# Altium project PROC101D_SCH_With_Design_Updates..Notes_V1.0.PrjPcb (part 21 of 23)

## Sheet 39.SchDoc
size 513 x 386 mm
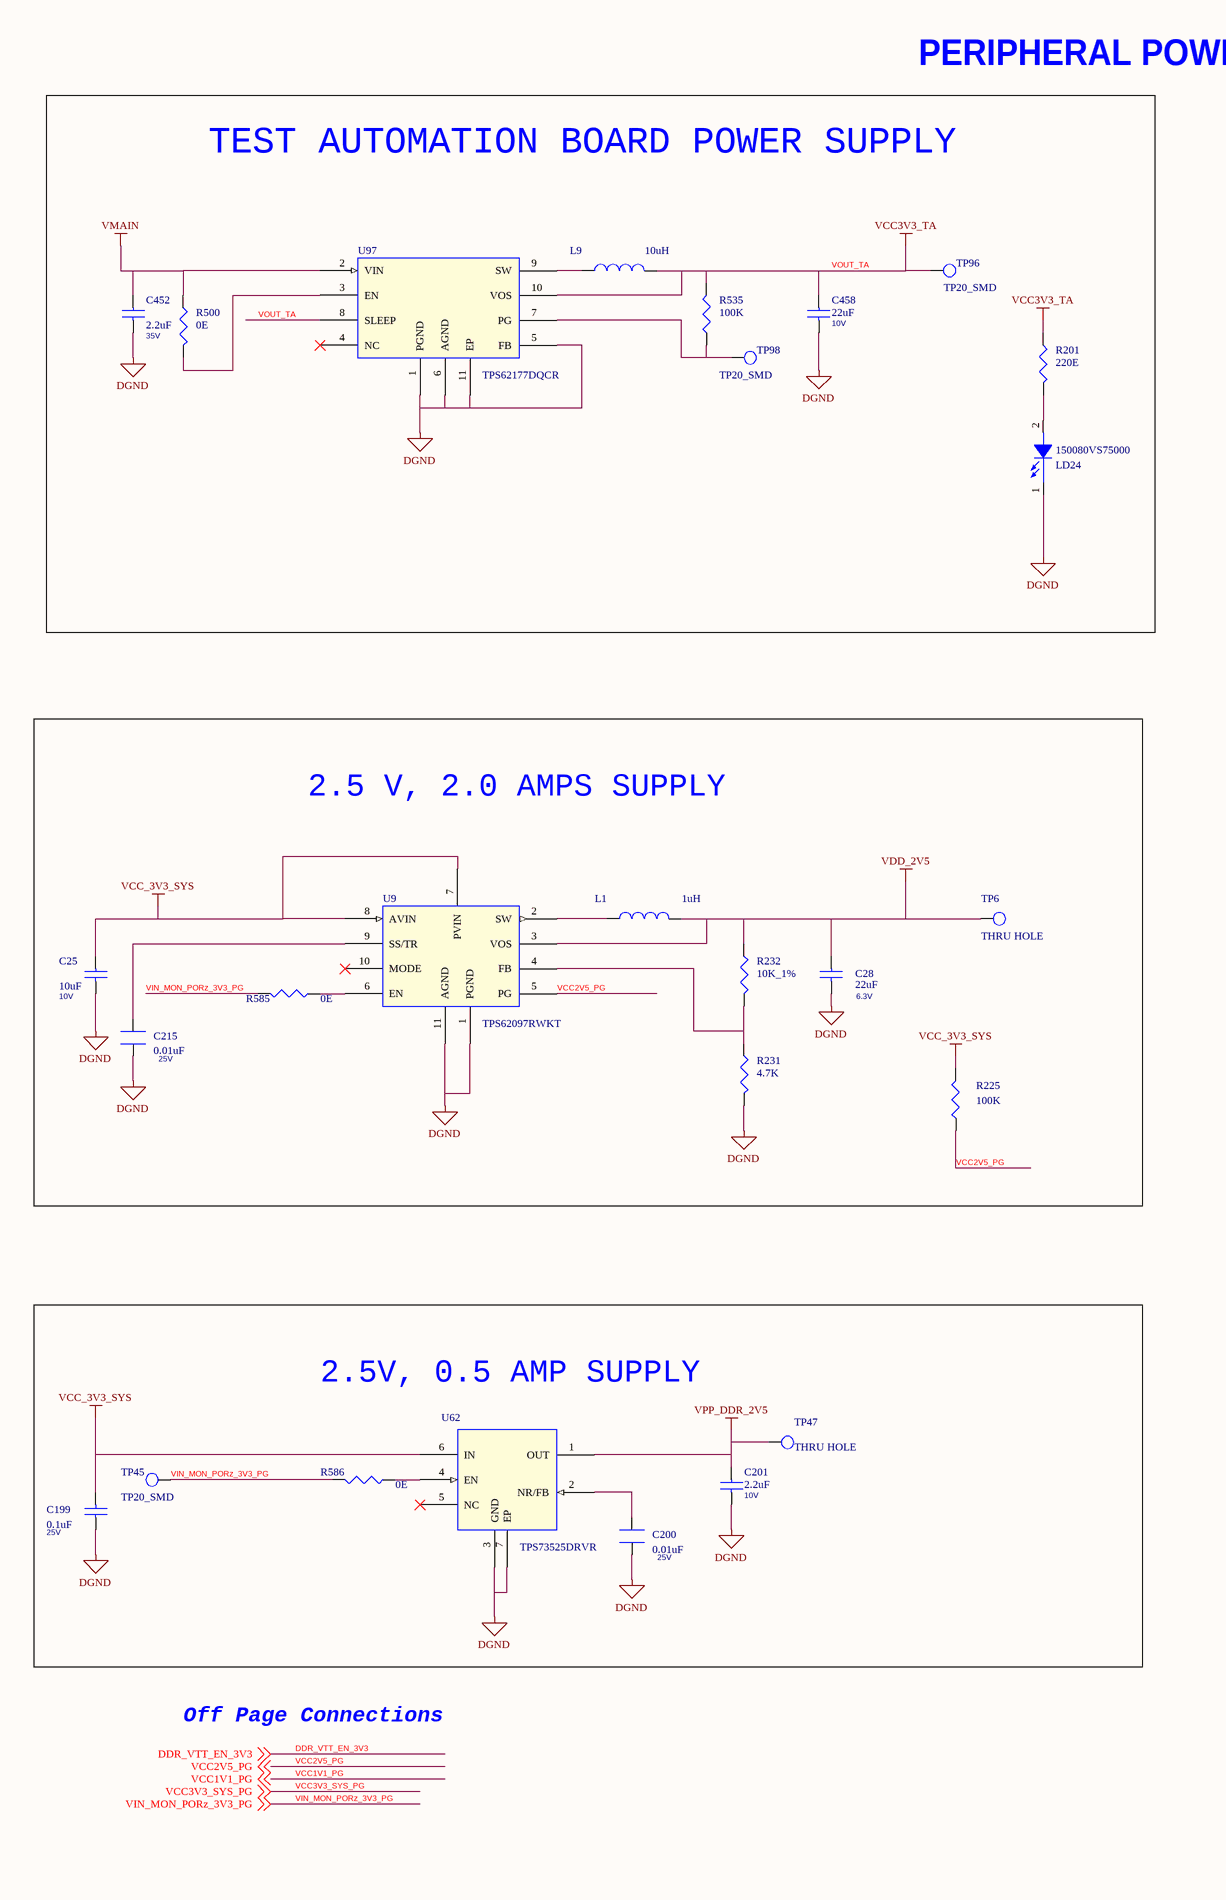
[diagram p74: 39.SchDoc, left]
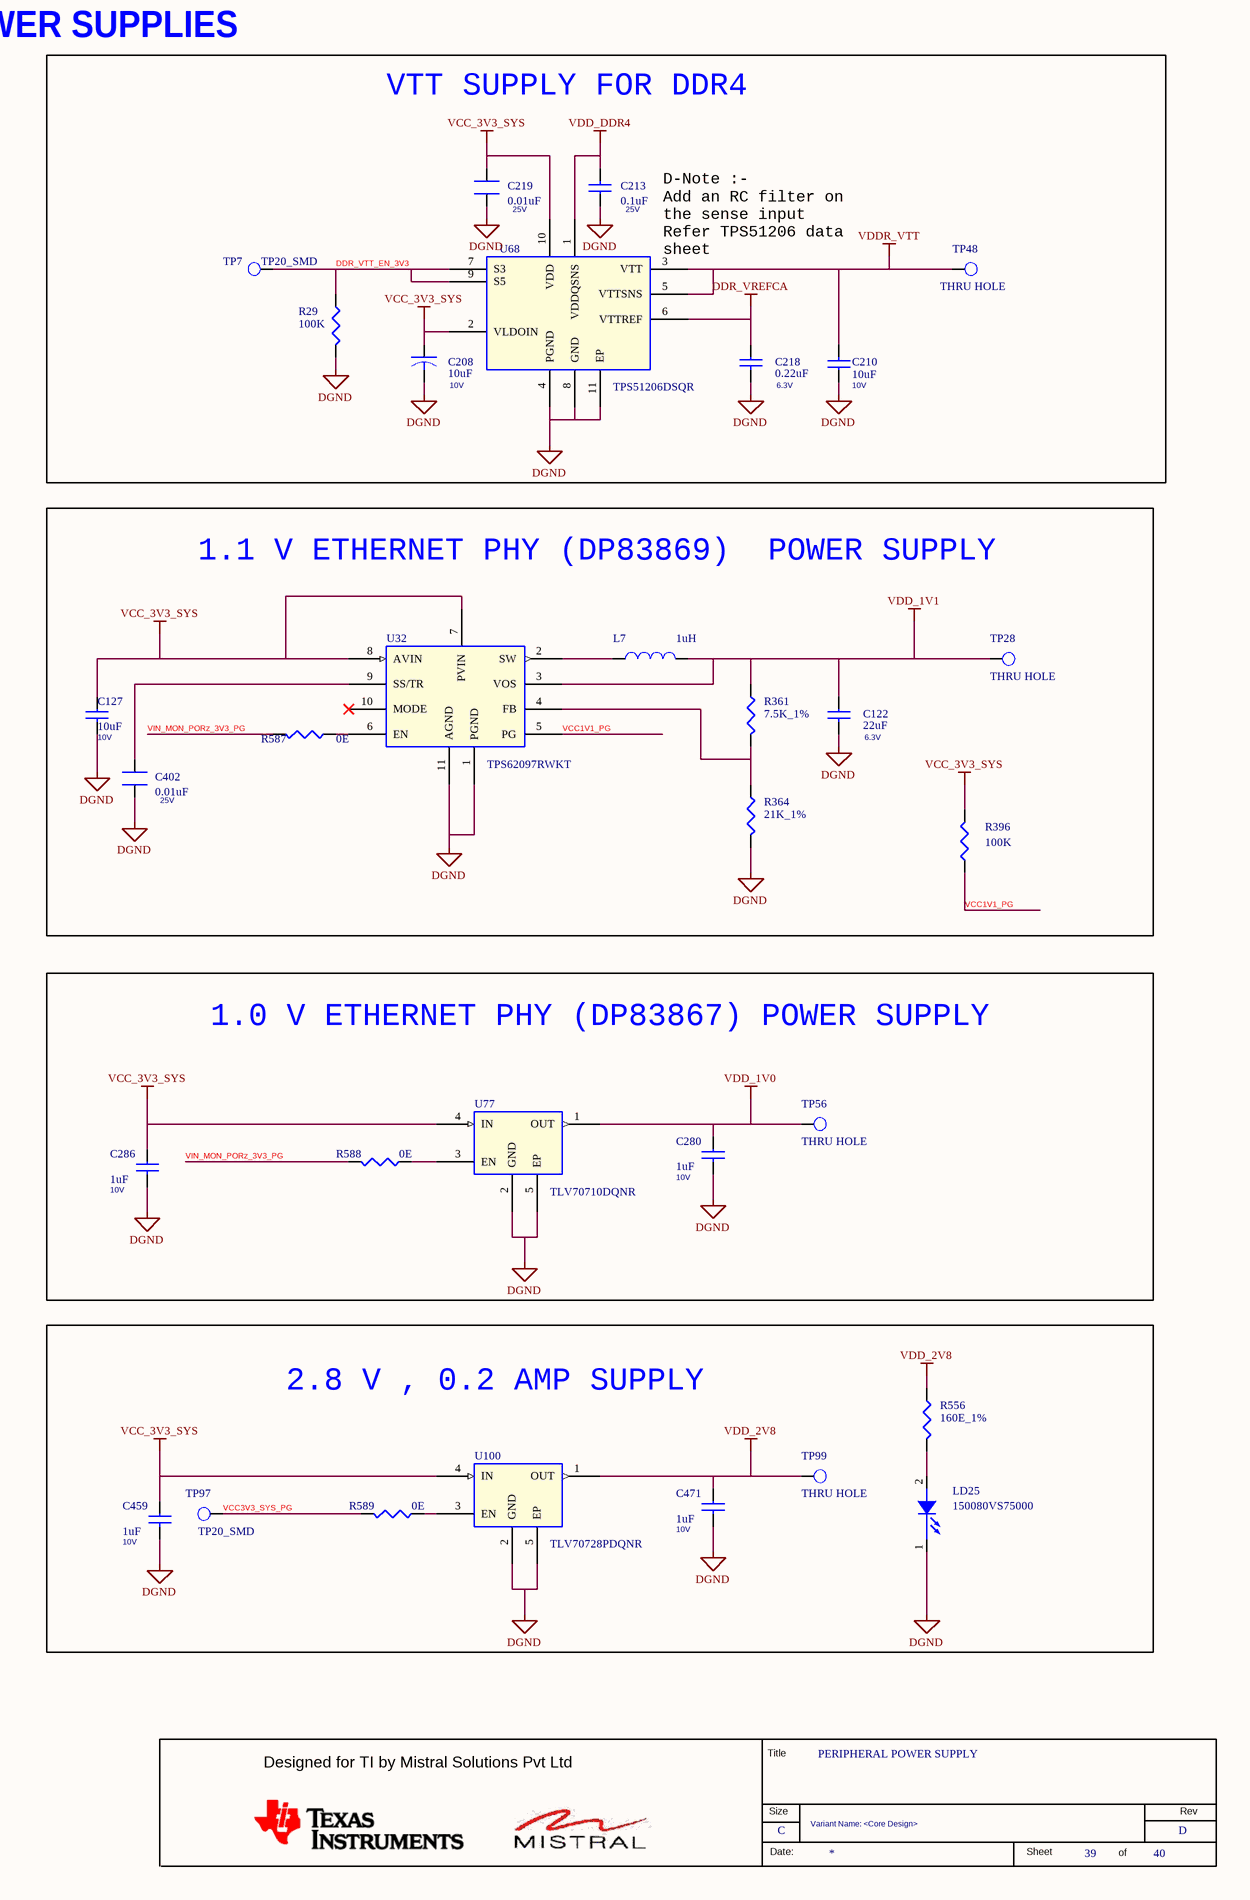
[diagram p75: 39.SchDoc, right]

### Parts
(Parts that share a designator on the sheet are numbered #1, #2 ... from top to bottom, then left to right.)
*#39  RevCode: D  Title: PERIPHERAL POWER SUPPLY  Page Size: C  Page Number: 39  Page Count: 40  Variant Name: <Core Design>  (hidden comment: MISTRAL_TITLEBLK_CSIZE)  (graphical)
C25  10uF  Voltage: 10V  [CAP0402_0-75]
C28  22uF  Voltage: 6.3V  [CAP0603_1]
C122  22uF  Voltage: 6.3V  [CAP0603_1]
C127  10uF  Voltage: 10V  [CAP0402_0-75]
C199  0.1uF  Voltage: 25V  [CAP0402_0-75]
C200  0.01uF  Voltage: 25V  [CAP0402N]
C201  2.2uF  Voltage: 10V  [CAP0402_0-75]
C208  10uF  Voltage: 10V  [CAP0402_0-75]
C210  10uF  Voltage: 10V  [CAP0402_0-75]
C213  0.1uF  Voltage: 25V  [CAP0402_0-75]
C215  0.01uF  Voltage: 25V  [CAP0402N]
C218  0.22uF  Voltage: 6.3V  [CAP0201_0-5]
C219  0.01uF  Voltage: 25V  [CAP0402N]
C280  1uF  Voltage: 10V  [CAP0402_0-75]
C286  1uF  Voltage: 10V  [CAP0402_0-75]
C402  0.01uF  Voltage: 25V  [CAP0402N]
C452  2.2uF  Voltage: 35V  [CAP0603_1]
C458  22uF  Voltage: 10V  [CAP0805_1-5]
C459  1uF  Voltage: 10V  [CAP0402_0-75]
C471  1uF  Voltage: 10V  [CAP0402_0-75]
L1  1uH  [IND_744316100_230X220_SMD_4-3]
L7  1uH  [IND_744316100_230X220_SMD_4-3]
L9  10uH  [IND_74438336100_130X130_SMD_2]
LD24  150080VS75000  [LED_150080VS75000_80X50_SMD_0-8]
LD25  150080VS75000  [LED_150080VS75000_80X50_SMD_0-8]
R29  100K  [RES0402_0-5]
R201  220E  [RES0402_0-5]
R225  100K  [RES0402_0-5]
R231  4.7K  [RES0402_0-5]
R232  10K_1%  [RES0402_0-5]
R361  7.5K_1%  [RES0402_0-5]
R364  21K_1%  [RES0402_0-5]
R396  100K  [RES0402_0-5]
R500  0E  [RES0402_0-5]
R535  100K  [RES0402_0-5]
R556  160E_1%  [RES0402_0-5]
R585  0E  [RES0402_0-5]
R586  0E  [RES0402_0-5]
R587  0E  [RES0402_0-5]
R588  0E  [RES0402_0-5]
R589  0E  [RES0402_0-5]
TP6  THRU HOLE  [TP_40X65]
TP7  TP20_SMD  [TP20_SMD]
TP28  THRU HOLE  [TP_40X65]
TP45  TP20_SMD  [TP20_SMD]
TP47  THRU HOLE  [TP_40X65]
TP48  THRU HOLE  [TP_40X65]
TP56  THRU HOLE  [TP_40X65]
TP96  TP20_SMD  [TP20_SMD]
TP97  TP20_SMD  [TP20_SMD]
TP98  TP20_SMD  [TP20_SMD]
TP99  THRU HOLE  [TP_40X65]
U9  TPS62097RWKT  [VQFNHR11_TPS62097_80X80_1]
U32  TPS62097RWKT  [VQFNHR11_TPS62097_80X80_1]
U62  TPS73525DRVR  [SON6_25-59_85X85_0-8]
U68  TPS51206DSQR  [EDFN10_15-74_80X80_0-8]
U77  TLV70710DQNR  [X2SON4_TLV71318P_40X40_0-4]
U97  TPS62177DQCR  [WSON10_19-68_80X120_0-8]
U100  TLV70728PDQNR  [X2SON4_TLV71318P_40X40_0-4]

### Blocks framed on the sheet
TEST AUTOMATION BOARD POWER SUPPLY: C452 C458 L9 LD24 R201 R500 R535 TP96 TP98 U97
VTT SUPPLY FOR DDR4: C208 C210 C213 C218 C219 R29 TP7 TP48 U68
1.1 V ETHERNET PHY (DP83869)  POWER SUPPLY: C122 C127 C402 L7 R361 R364 R396 R587 TP28 U32
2.5 V, 2.0 AMPS SUPPLY: C25 C28 C215 L1 R225 R231 R232 R585 TP6 U9
1.0 V ETHERNET PHY (DP83867) POWER SUPPLY: C280 C286 R588 TP56 U77
2.5V, 0.5 AMP SUPPLY: C199-C201 R586 TP45 TP47 U62
2.8 V , 0.2 AMP SUPPLY: C459 C471 LD25 R556 R589 TP97 TP99 U100

### Nets
DDR_VREFCA: C218.1 U68.6(VTTREF)
DGND: C25.2 C28.2 C122.2 C127.2 C199.1 C200.2 C201.2 C208.2 C210.1 C213.1 C215.2 C218.2 C219.2 C280.2 C286.2 C402.2 C452.2 C458.2 C459.2 C471.2 LD24.1(CATHODE) LD25.1(CATHODE) R29.2 R231.2 R364.2 U9.1(PGND) U9.11(AGND) U32.1(PGND) U32.11(AGND) U62.3(GND) U62.7(EP) U68.4(PGND) U68.8(GND) U68.11(EP) U77.2(GND) U77.5(EP) U97.1(PGND) U97.5(FB) U97.6(AGND) U97.11(EP) U100.2(GND) U100.5(EP)
VCC_3V3_SYS: C25.1 C127.1 C199.2 C208.1 C219.1 C286.1 C459.1 R225.2 R396.2 U9.7(PVIN) U9.8(AVIN) U32.7(PVIN) U32.8(AVIN) U62.6(IN) U68.2(VLDOIN) U68.10(VDD) U77.4(IN) U100.4(IN)
VDD_1V0: C280.1 TP56.1(TP) U77.1(OUT)
VDD_1V1: C122.1 L7.2 R361.1 TP28.1(TP) U32.3(VOS)
VDD_2V5: C28.1 L1.2 R232.1 TP6.1(TP) U9.3(VOS)
VDD_2V8: C471.1 R556.1 TP99.1(TP) U100.1(OUT)
VDD_DDR4: C213.2 U68.1(VDDQSNS)
VDDR_VTT: C210.2 TP48.1(TP) U68.3(VTT) U68.5(VTTSNS)
VMAIN: C452.1 R500.1 U97.2(VIN)
VOUT_TA: C458.1 L9.2 R201.1 R535.2 TP96.1(TP) U97.8(SLEEP) U97.10(VOS)  [also labelled VCC3V3_TA]
VPP_DDR_2V5: C201.1 TP47.1(TP) U62.1(OUT)
DDR_VTT_EN_3V3: R29.1 TP7.1(TP) U68.7(S3) U68.9(S5) ; off-sheet DDR_VTT_EN_3V3
VCC1V1_PG: R396.1 U32.5(PG) ; off-sheet VCC1V1_PG
VCC2V5_PG: R225.1 U9.5(PG) ; off-sheet VCC2V5_PG
VCC3V3_SYS_PG: R589.2 TP97.1(TP) ; off-sheet VCC3V3_SYS_PG
VIN_MON_PORz_3V3_PG: R585.2 R586.2 R587.2 R588.2 TP45.1(TP) ; off-sheet VIN_MON_PORz_3V3_PG
NetC200_1: C200.1 U62.2(NR/FB)
NetC215_1: C215.1 U9.9(SS/TR)
NetC402_1: C402.1 U32.9(SS/TR)
NetL1_1: L1.1 U9.2(SW)
NetL7_1: L7.1 U32.2(SW)
NetL9_1: L9.1 U97.9(SW)
NetLD24_2: LD24.2(ANODE) R201.2
NetLD25_2: LD25.2(ANODE) R556.2
NetR231_1: R231.1 R232.2 U9.4(FB)
NetR361_2: R361.2 R364.1 U32.4(FB)
NetR500_2: R500.2 U97.3(EN)
NetR535_1: R535.1 TP98.1(TP) U97.7(PG)
NetR585_1: R585.1 U9.6(EN)
NetR586_1: R586.1 U62.4(EN)
NetR587_1: R587.1 U32.6(EN)
NetR588_1: R588.1 U77.3(EN)
NetR589_1: R589.1 U100.3(EN)

Not connected (* = marked no-connect by the designer): U9 10(MODE)*; U32 10(MODE)*; U62 5(NC)*; U97 4(NC)*

### Notes on the sheet
- PERIPHERAL POWER SUPPLIES
- (near U68) D-Note :-
  Add an RC filter on
  the sense input
  Refer TPS51206 data
  sheet
- Off Page Connections
- (in symbol MISTRAL_TITLEBLK_CSIZE) Title; Designed for TI by Mistral Solutions Pvt Ltd; Size; Rev; Date:; Sheet; of

### Library data of the parts
*#39 = MISTRAL_TITLEBLK_CSIZE: Issue: 1.0; Page Create Date: March  8, 1995; Page Modify Date: *
C25 C127 = CAP_Dup3: as C77 on sheet 38; Footprint Path: Y:\MIS_DATABASE\Library\ALTIUM_TOOL\PCB_FOOTPRINTS\Altium_Footprint_Lib.PcbLib; Library Path: Y:\MIS_DATABASE\Library\ALTIUM_TOOL\SCHEMATICS_PARTS\MS_DISCRETE_Library.schlib; Footprint Ref: CAP0402_0-75; Library Ref: CAP; Tolerance: 20%; Package: 0402; Distributor_name: DIGIKEY; Distributor_part_number: 490-GRM155R61A106ME11DTR-ND; Height: 0.55MM; Weight: 3.1mg; Temperature: -55癈+85癈; Datasheet: Y:\MIS_DATABASE\DATASHEETS\CAPACITORS\MURATA-GXX-SER_NOV17.PDF; Crtd /date: ALVY/260520; Chkd/date: MANIRAJA/300520; MECHANICAL 3D STEP FILE: CAP0402_0-75; PCB Footprint: CAP0402_0-75
C28 C122 = CAP_Dup3: as C46 on sheet 37; Chkd/date: JEBRAN/090915; Crtd /date: JEBRAN/090915; Datasheet: Y:\MIS_DATABASE\DATASHEETS\CAPACITORS\MURATA-GXX-SER_NOV17.PDF; Temperature: -55癈+85癈; Weight: 6.3mg; Height: 1.00MM; Distributor_part_number: 490-7611-2-ND; Distributor_name: DIGIKEY; Package: 0603; Tolerance: 20%; Library Ref: CAP; Footprint Ref: CAP0603_1; MECHANICAL 3D STEP FILE: CAP0603_1; Library Path: Y:\MIS_DATABASE\Library\ALTIUM_TOOL\SCHEMATICS_PARTS\MS_DISCRETE_Library.schlib; Footprint Path: Y:\MIS_DATABASE\Library\ALTIUM_TOOL\PCB_FOOTPRINTS\Altium_Footprint_Lib.PcbLib; PCB Footprint: CAP0603_1
C199 C213 = CAP_Dup3: as C54 on sheet 37; Tolerance: 20%; Package: 0402; Distributor_name: DIGIKEY; Distributor_part_number: 732-7495-1-ND; Height: 0.55MM; Weight: 0.65mg; Temperature: -55癈+85癈; Datasheet: Y:\MIS_DATABASE\DATASHEETS\CAPACITORS\885012105018.PDF; Crtd /date: ALVY/170820; Chkd/date: MANIRAJA/170820; MECHANICAL 3D STEP FILE: CAP0402_0-75; Library Ref: CAP; Footprint Ref: CAP0402_0-75; Library Path: Y:\MIS_DATABASE\Library\ALTIUM_TOOL\SCHEMATICS_PARTS\MS_DISCRETE_Library.schlib; Footprint Path: Y:\MIS_DATABASE\Library\ALTIUM_TOOL\PCB_FOOTPRINTS\Altium_Footprint_Lib.PcbLib; PCB Footprint: CAP0402_0-75
C200 C215 C402 = CAP_Dup2: CAP CERAMIC 0.01uF 25V 10% X7R 0402; Mistral Part No: 120011090040-R; Mfr_name: WURTH ELECTRONICS; Mfr_part_number: 885012205050; Part_type: CAPACITORS\CERAMIC; Project: AM64x_EVM_BRD; Customs_HS_Code: 85322990; Custom_Duty: 15%; Wattage: NA; MECHANICAL 3D STEP FILE: CAP0402_0-75; Library Ref: CAP; Tolerance: 10%; Package: 0402; Distributor_name: DIGIKEY; Distributor_part_number: 732-7545-1-ND; Height: 0.55MM; Datasheet: Y:\MIS_DATABASE\DATASHEETS\CAPACITORS\885012205050.PDF; Crtd /date: ALVY/170820; Chkd/date: MANIRAJA/170820; Weight: 0.65mg; Temperature: -55癈+125癈; Footprint Ref: CAP0402_0-75; Library Path: Y:\MIS_DATABASE\Library\ALTIUM_TOOL\SCHEMATICS_PARTS\MS_DISCRETE_Library.schlib; Footprint Path: Y:\MIS_DATABASE\Library\ALTIUM_TOOL\PCB_FOOTPRINTS\Altium_Footprint_Lib.PcbLib; PCB Footprint: CAP0402_0-75
C201 = CAP_Dup3: as C129 on sheet 38; Library Ref: CAP; Tolerance: 20%; Package: 0402; Distributor_name: DIGIKEY; Distributor_part_number: 732-7490-1-ND; Height: 0.55MM; Weight: 0.65mg; Temperature: -55癈+85癈; Datasheet: Y:\MIS_DATABASE\DATASHEETS\CAPACITORS\885012105013.PDF; Crtd /date: ALVY/170820; Chkd/date: MANIRAJA/170820; MECHANICAL 3D STEP FILE: CAP0402_0-75; Footprint Ref: CAP0402_0-75; Library Path: Y:\MIS_DATABASE\Library\ALTIUM_TOOL\SCHEMATICS_PARTS\MS_DISCRETE_Library.schlib; Footprint Path: Y:\MIS_DATABASE\Library\ALTIUM_TOOL\PCB_FOOTPRINTS\Altium_Footprint_Lib.PcbLib; PCB Footprint: CAP0402_0-75
C208 = CAP_Dup1: CAP CERAMIC 10uF 10V 20% X5R 0402; Part_type: CAPACITORS\CERAMIC; Mfr_part_number: GRM155R61A106ME11D; Mfr_name: MURATA; Mistral Part No: 120013110019-R; Custom_Duty: 15%; Customs_HS_Code: 85322990; Wattage: NA; Project: QCS610_NANOSOM; Chkd/date: MANIRAJA/300520; Crtd /date: ALVY/260520; Datasheet: Y:\MIS_DATABASE\DATASHEETS\CAPACITORS\MURATA-GXX-SER_NOV17.PDF; Temperature: -55癈+85癈; Weight: 3.1mg; Height: 0.55MM; Distributor_part_number: 490-GRM155R61A106ME11DTR-ND; Distributor_name: DIGIKEY; Package: 0402; Tolerance: 20%; MECHANICAL 3D STEP FILE: CAP0402_0-75; Library Ref: CAP; Footprint Ref: CAP0402_0-75; Library Path: Y:\MIS_DATABASE\Library\ALTIUM_TOOL\SCHEMATICS_PARTS\MS_DISCRETE_Library.schlib; Footprint Path: Y:\MIS_DATABASE\Library\ALTIUM_TOOL\PCB_FOOTPRINTS\Altium_Footprint_Lib.PcbLib; PCB Footprint: CAP0402_0-75
C210 = CAP_Dup3: CAP CERAMIC 10uF 10V 20% X5R 0402; Part_type: CAPACITORS\CERAMIC; Mfr_part_number: GRM155R61A106ME11D; Mfr_name: MURATA; Mistral Part No: 120013110019-R; Custom_Duty: 15%; Customs_HS_Code: 85322990; Project: QCS610_NANOSOM; Wattage: NA; Chkd/date: MANIRAJA/300520; Crtd /date: ALVY/260520; Datasheet: Y:\MIS_DATABASE\DATASHEETS\CAPACITORS\MURATA-GXX-SER_NOV17.PDF; Height: 0.55MM; Distributor_part_number: 490-GRM155R61A106ME11DTR-ND; Distributor_name: DIGIKEY; Package: 0402; Tolerance: 20%; Weight: 3.1mg; Temperature: -55癈+85癈; MECHANICAL 3D STEP FILE: CAP0402_0-75; Library Ref: CAP; Footprint Ref: CAP0402_0-75; Library Path: Y:\MIS_DATABASE\Library\ALTIUM_TOOL\SCHEMATICS_PARTS\MS_DISCRETE_Library.schlib; Footprint Path: Y:\MIS_DATABASE\Library\ALTIUM_TOOL\PCB_FOOTPRINTS\Altium_Footprint_Lib.PcbLib; PCB Footprint: CAP0402_0-75
C218 = CAP_Dup3: CAP CERAMIC 0.22uF 6.3V 10% X6S 0201; Part_type: CAPACITORS\CERAMIC; Mfr_part_number: GRM033C80J224KE90D; Mfr_name: MURATA; Mistral Part No: 120021060017-R; Custom_Duty: 15%; Customs_HS_Code: 85322990; Wattage: NA; Project: TI_J7AEP_EVM; Footprint Path: Y:\MIS_DATABASE\Library\ALTIUM_TOOL\PCB_FOOTPRINTS\Altium_Footprint_Lib.PcbLib; Library Path: Y:\MIS_DATABASE\Library\ALTIUM_TOOL\SCHEMATICS_PARTS\MS_DISCRETE_Library.schlib; Footprint Ref: CAP0201_0-5; MECHANICAL 3D STEP FILE: CAP0201_0-5; Chkd/date: ALVY/290621; Crtd /date: MANIRAJA/290621; Datasheet: Y:\MIS_DATABASE\DATASHEETS\CAPACITORS\GRM033C80J224KE90.PDF; Temperature: -55癈+105癈; Weight: 0.33mg; Height: 0.33MM; Distributor_part_number: 490-10392-1-ND; Distributor_name: DIGIKEY; Package: 0201; Tolerance: 10%; Library Ref: CAP; PCB Footprint: CAP0201_0-5
C219 = CAP_Dup2: as C202 on sheet 38; Footprint Path: Y:\MIS_DATABASE\Library\ALTIUM_TOOL\PCB_FOOTPRINTS\Altium_Footprint_Lib.PcbLib; Library Path: Y:\MIS_DATABASE\Library\ALTIUM_TOOL\SCHEMATICS_PARTS\MS_DISCRETE_Library.schlib; Footprint Ref: CAP0402_0-75; Temperature: -55癈+125癈; Weight: 0.65mg; Chkd/date: MANIRAJA/170820; Crtd /date: ALVY/170820; Datasheet: Y:\MIS_DATABASE\DATASHEETS\CAPACITORS\885012205050.PDF; Height: 0.55MM; Distributor_part_number: 732-7545-1-ND; Distributor_name: DIGIKEY; Package: 0402; Tolerance: 10%; Library Ref: CAP; PCB Footprint: CAP0402_0-75
C280 C286 C459 C471 = CAP_Dup3: as C137 on sheet 37; Library Ref: CAP; MECHANICAL 3D STEP FILE: CAP0402_0-75; Chkd/date: MANIRAJA/210820; Crtd /date: ALVY/190820; Datasheet: Y:\MIS_DATABASE\DATASHEETS\CAPACITORS\885012105012.PDF; Temperature: -55癈+85癈; Weight: 0.65mg; Height: 0.55MM; Distributor_part_number: 732-7489-1-ND; Distributor_name: DIGIKEY; Package: 0402; Tolerance: 20%; Footprint Ref: CAP0402_0-75; Library Path: Y:\MIS_DATABASE\Library\ALTIUM_TOOL\SCHEMATICS_PARTS\MS_DISCRETE_Library.schlib; Footprint Path: Y:\MIS_DATABASE\Library\ALTIUM_TOOL\PCB_FOOTPRINTS\Altium_Footprint_Lib.PcbLib; PCB Footprint: CAP0402_0-75
C452 = CAP: as C107 on sheet 37; Footprint Ref: CAP0603_1; Tolerance: 10%; Package: 0603; Distributor_name: DIGIKEY; Distributor_part_number: 490-7204-1-ND; Library Ref: CAP; Height: 0.90MM; Weight: 6.3mg; Temperature: -55癈+85癈; Datasheet: Y:\MIS_DATABASE\DATASHEETS\CAPACITORS\MURATA-GXX-SER_NOV17.PDF; Crtd /date: MANIRAJA/270117; Chkd/date: VASANTHA/270117; MECHANICAL 3D STEP FILE: CAP0603_1; Library Path: Y:\MIS_DATABASE\Library\ALTIUM_TOOL\SCHEMATICS_PARTS\MS_DISCRETE_Library.schlib; Footprint Path: Y:\MIS_DATABASE\Library\ALTIUM_TOOL\PCB_FOOTPRINTS\Altium_Footprint_Lib.PcbLib; PCB Footprint: CAP0603_1
C458 = CAP_Dup3: CAP CERAMIC 22uF 10V 20% X5R 0805; Mistral Part No: 120020080010-R; Mfr_name: WURTH ELECTRONICS; Mfr_part_number: 885012107011; Part_type: CAPACITORS\CERAMIC; Project: AM64x_EVM_BRD; Wattage: NA; Customs_HS_Code: 85322990; Custom_Duty: 15%; Tolerance: 20%; Package: 0805; Distributor_name: DIGIKEY; Distributor_part_number: 732-7621-1-ND; Library Ref: CAP; Height: 1.45MM; Weight: 5.5mg; Temperature: -55癈+85癈; Datasheet: Y:\MIS_DATABASE\DATASHEETS\CAPACITORS\885012107011.PDF; Crtd /date: ALVY/190820; Chkd/date: MANIRAJA/210820; MECHANICAL 3D STEP FILE: CAP0805_1-5; Footprint Ref: CAP0805_1-5; Library Path: Y:\MIS_DATABASE\Library\ALTIUM_TOOL\SCHEMATICS_PARTS\MS_DISCRETE_Library.schlib; Footprint Path: Y:\MIS_DATABASE\Library\ALTIUM_TOOL\PCB_FOOTPRINTS\Altium_Footprint_Lib.PcbLib; PCB Footprint: CAP0805_1-5
L1 L7 = INDUCTOR: as L2 on sheet 38; PCB Footprint: IND_744316100_230X220_SMD_4-3; Footprint Ref: IND_744316100_230X220_SMD_4-3; Part_type: INDUCTOR; Tolerance: 20%; Wattage: NA; Package: SMD; Distributor_name: DIGIKEY; Distributor_part_number: 732-6176-1-ND; Library Ref: INDUCTOR; Height: 4.30MM; Weight: 570mg; Temperature: -40癈+150癈; Datasheet: Y:\MIS_DATABASE\DATASHEETS\DISCRETES\INDUCTORS\744316100.PDF; Crtd /date: ALVY/280520; Chkd/date: MANIRAJA/280520; MECHANICAL 3D STEP FILE: IND_744316100_230X220_SMD_4-3; Library Path: Y:\MIS_DATABASE\Library\ALTIUM_TOOL\SCHEMATICS_PARTS\MS_DISCRETE_Library.schlib; Footprint Path: Y:\MIS_DATABASE\Library\ALTIUM_TOOL\PCB_FOOTPRINTS\Altium_Footprint_Lib.PcbLib
L9 = INDUCTOR: IND POWER 10uH 1.2A 20% SMD; Mfr_part_number: 74438336100; Mfr_name: WURTH ELECTRONICS INC; Mistral Part No: 130017090020-R; Custom_Duty: 24%; Customs_HS_Code: 85369090; Wattage: NA; Project: P4_RADAR_DI; MECHANICAL 3D STEP FILE: IND_74438336100_130X130_SMD_2; Chkd/date: MANIRAJA/180917; Crtd /date: MANIRAJA/180917; Datasheet: Y:\MIS_DATABASE\DATASHEETS\DISCRETES\INDUCTORS\74438336100.PDF; Temperature: -40癈+125癈; Weight: NA; Height: 2.00MM; Library Ref: INDUCTOR; Distributor_part_number: 732-5700-1-ND; Distributor_name: DIGIKEY; Package: SMD; Voltage: NA; Tolerance: 20%; Part_type: INDUCTOR; PCB Footprint: IND_74438336100_130X130_SMD_2
LD24 = DIODE_LED: DIODE LED BRIGHT GREEN SMD; Mistral Part No: 130020080012-R; Mfr_name: WURTH ELECTRONICS; Part_type: OPTO\LED; Project: AM64x_EVM_BRD; Tolerance: NA; Customs_HS_Code: 85439000; Custom_Duty: 24%; PCB Footprint: LED_150080VS75000_80X50_SMD_0-8; Footprint Ref: LED_150080VS75000_80X50_SMD_0-8; Mfr_part_number: 150080VS75000; Voltage: NA; Wattage: NA; Package: SMD; Distributor_name: DIGIKEY; Distributor_part_number: 732-4986-1-ND; Library Ref: DIODE_LED; Height: 0.80MM; Weight: 10mg; Temperature: -40癈+85癈; Datasheet: Y:\MIS_DATABASE\DATASHEETS\DISCRETES\LEDS\150080VS75000.PDF; Crtd /date: ALVY/180820; Chkd/date: MANIRAJA/180820; MECHANICAL 3D STEP FILE: LED_150080VS75000_80X50_SMD_0-8; Library Path: Y:\MIS_DATABASE\Library\ALTIUM_TOOL\SCHEMATICS_PARTS\MS_OPTO_Library.schlib; Footprint Path: Y:\MIS_DATABASE\Library\ALTIUM_TOOL\PCB_FOOTPRINTS\Altium_Footprint_Lib.PcbLib
LD25 = DIODE_LED: as LD4 on sheet 37; PCB Footprint: LED_150080VS75000_80X50_SMD_0-8; Footprint Path: Y:\MIS_DATABASE\Library\ALTIUM_TOOL\PCB_FOOTPRINTS\Altium_Footprint_Lib.PcbLib; Library Path: Y:\MIS_DATABASE\Library\ALTIUM_TOOL\SCHEMATICS_PARTS\MS_OPTO_Library.schlib; MECHANICAL 3D STEP FILE: LED_150080VS75000_80X50_SMD_0-8; Chkd/date: MANIRAJA/180820; Crtd /date: ALVY/180820; Datasheet: Y:\MIS_DATABASE\DATASHEETS\DISCRETES\LEDS\150080VS75000.PDF; Temperature: -40癈+85癈; Weight: 10mg; Height: 0.80MM; Library Ref: DIODE_LED; Distributor_part_number: 732-4986-1-ND; Distributor_name: DIGIKEY; Package: SMD; Voltage: NA; Tolerance: NA; Mfr_part_number: 150080VS75000; Footprint Ref: LED_150080VS75000_80X50_SMD_0-8
R29 = RESISTOR_Dup5: RES 100K 1/16W 5% 0402; Mistral Part No: 110011060002-R; Mfr_name: VISHAY; Mfr_part_number: CRCW0402100KJNED; Part_type: RESISTORS\FIXED; Project: AM4515_EVM_LCD; Voltage: NA; Customs_HS_Code: 85332119; Custom_Duty: 15%; Footprint Path: Y:\MIS_DATABASE\Library\ALTIUM_TOOL\PCB_FOOTPRINTS\Altium_Footprint_Lib.PcbLib; Library Path: Y:\MIS_DATABASE\Library\ALTIUM_TOOL\SCHEMATICS_PARTS\MS_DISCRETE_Library.schlib; Footprint Ref: RES0402_0-5; Library Ref: RESISTOR; MECHANICAL 3D STEP FILE: RES0402_0-5; Tolerance: 5%; Wattage: 1/16W; Package: 0402; Distributor_name: DIGIKEY; Distributor_part_number: 541-100KJCT-ND; Height: 0.40MM; Weight: 0.65mg; Temperature: -55癈+155癈; Datasheet: Y:\MIS_DATABASE\DATASHEETS\RESISTORS\CRCW0603.PDF; Crtd /date: BAVISH/010611; Chkd/date: VASANTHA/061216; PCB Footprint: RES0402_0-5
R201 = RESISTOR_Dup6: as R276 on sheet 37; Footprint Ref: RES0402_0-5; Library Ref: RESISTOR; Tolerance: 5%; Wattage: 1/10W; Package: 0402; Distributor_name: DIGIKEY; Distributor_part_number: P220JCT-ND; Height: 0.40MM; Datasheet: Y:\MIS_DATABASE\DATASHEETS\RESISTORS\PAN-ERJSER_NOV17.PDF; Crtd /date: GEETHA/260406; Chkd/date: VASANTHA/291216; Weight: 0.8mg; Temperature: -55癈+155癈; MECHANICAL 3D STEP FILE: RES0402_0-5; Library Path: Y:\MIS_DATABASE\Library\ALTIUM_TOOL\SCHEMATICS_PARTS\MS_DISCRETE_Library.schlib; Footprint Path: Y:\MIS_DATABASE\Library\ALTIUM_TOOL\PCB_FOOTPRINTS\Altium_Footprint_Lib.PcbLib; PCB Footprint: RES0402_0-5
R225 R396 = RESISTOR_Dup6: as R134 on sheet 37; Footprint Path: Y:\MIS_DATABASE\Library\ALTIUM_TOOL\PCB_FOOTPRINTS\Altium_Footprint_Lib.PcbLib; Library Path: Y:\MIS_DATABASE\Library\ALTIUM_TOOL\SCHEMATICS_PARTS\MS_DISCRETE_Library.schlib; Footprint Ref: RES0402_0-5; Library Ref: RESISTOR; MECHANICAL 3D STEP FILE: RES0402_0-5; Chkd/date: VASANTHA/061216; Crtd /date: BAVISH/010611; Datasheet: Y:\MIS_DATABASE\DATASHEETS\RESISTORS\CRCW0603.PDF; Temperature: -55癈+155癈; Weight: 0.65mg; Height: 0.40MM; Distributor_part_number: 541-100KJCT-ND; Distributor_name: DIGIKEY; Package: 0402; Wattage: 1/16W; Tolerance: 5%; PCB Footprint: RES0402_0-5
R231 = RESISTOR_Dup4: RES 4.7K 1/16W 5% 0402; Mistral Part No: 110011060001-R; Mfr_name: YAGEO AMERICA; Mfr_part_number: RC0402JR-074K7L; Part_type: RESISTORS\FIXED; Project: TMDXCSK368; Voltage: NA; Customs_HS_Code: 85332119; Custom_Duty: 15%; PCB Footprint: RES0402_0-5; Tolerance: 5%; Wattage: 1/16W; Package: 0402; Distributor_name: DIGIKEY; Distributor_part_number: 311-4.7KJRCT-ND; Height: 0.40MM; Weight: 0.65mg; Temperature: -55癈+155癈; Datasheet: Y:\MIS_DATABASE\DATASHEETS\RESISTORS\RCXXXXL-SER_MAR18.PDF; Crtd /date: VASANTHA/130516; Chkd/date: VASANTHA/130516; Library Ref: RESISTOR; Footprint Ref: RES0402_0-5; MECHANICAL 3D STEP FILE: RES0402_0-5; Library Path: Y:\MIS_DATABASE\Library\ALTIUM_TOOL\SCHEMATICS_PARTS\MS_DISCRETE_Library.schlib; Footprint Path: Y:\MIS_DATABASE\Library\ALTIUM_TOOL\PCB_FOOTPRINTS\Altium_Footprint_Lib.PcbLib
R232 = RESISTOR_Dup6: RES 10K 1/16W 1% 0402; Mistral Part No: 110015090015-R; Mfr_name: YAGEO AMERICA; Mfr_part_number: RC0402FR-0710KL; Part_type: RESISTORS\FIXED; Project: VOCERA; Voltage: NA; Customs_HS_Code: 85332119; Custom_Duty: 15%; PCB Footprint: RES0402_0-5; Footprint Path: Y:\MIS_DATABASE\Library\ALTIUM_TOOL\PCB_FOOTPRINTS\Altium_Footprint_Lib.PcbLib; Library Path: Y:\MIS_DATABASE\Library\ALTIUM_TOOL\SCHEMATICS_PARTS\MS_DISCRETE_Library.schlib; Footprint Ref: RES0402_0-5; Library Ref: RESISTOR; MECHANICAL 3D STEP FILE: RES0402_0-5; Tolerance: 1%; Wattage: 1/16W; Package: 0402; Distributor_name: DIGIKEY; Distributor_part_number: 311-10.0KLRTR-ND; Height: 0.40MM; Weight: 0.65mg; Temperature: -55癈+155癈; Datasheet: Y:\MIS_DATABASE\DATASHEETS\RESISTORS\RCXXXXL-SER_MAR18.PDF; Crtd /date: GEETHA/290506; Chkd/date: VASANTHA/201216
R361 = RESISTOR: RES 7.5K 1/16W 1% 0402; Part_type: RESISTORS\FIXED; Mfr_part_number: CRCW04027K50FKED; Mfr_name: VISHAY; Mistral Part No: 110019060009-R; Custom_Duty: 15%; Customs_HS_Code: 85332119; Voltage: NA; Project: MYTHIC_FORMFACTOR_BRD; Footprint Path: Y:\MIS_DATABASE\Library\ALTIUM_TOOL\PCB_FOOTPRINTS\Altium_Footprint_Lib.PcbLib; Library Path: Y:\MIS_DATABASE\Library\ALTIUM_TOOL\SCHEMATICS_PARTS\MS_DISCRETE_Library.schlib; MECHANICAL 3D STEP FILE: RES0402_0-5; Chkd/date: MANIRAJA/060619; Crtd /date: ALVY/040619; Datasheet: Y:\MIS_DATABASE\DATASHEETS\RESISTORS\CRCW0603.PDF; Temperature: -55癈+155癈; Weight: 0.65mg; Height: 0.40MM; Library Ref: RESISTOR; Distributor_part_number: 541-7.50KLCT-ND; Distributor_name: DIGIKEY; Package: 0402; Wattage: 1/16W; Tolerance: 1%; Footprint Ref: RES0402_0-5; PCB Footprint: RES0402_0-5
R364 = RESISTOR_Dup1: RES 21K 1/16W 1% 0402; Mistral Part No: 110015080019-R; Mfr_name: YAGEO AMERICA; Mfr_part_number: RC0402FR-0721KL; Part_type: RESISTORS\FIXED; Project: OCTASIC_3000; Voltage: NA; Customs_HS_Code: 85332119; Custom_Duty: 15%; Footprint Ref: RES0402_0-5; Tolerance: 1%; Wattage: 1/16W; Package: 0402; Distributor_name: DIGIKEY; Distributor_part_number: 311-21.0KLRCT-ND; Library Ref: RESISTOR; Height: 0.40MM; Weight: 0.65mg; Temperature: -55癈+155癈; Datasheet: Y:\MIS_DATABASE\DATASHEETS\RESISTORS\RCXXXXL-SER_MAR18.PDF; Crtd /date: MANIRAJA/200319; Chkd/date: MANIRAJA/200319; MECHANICAL 3D STEP FILE: RES0402_0-5; Library Path: Y:\MIS_DATABASE\Library\ALTIUM_TOOL\SCHEMATICS_PARTS\MS_DISCRETE_Library.schlib; Footprint Path: Y:\MIS_DATABASE\Library\ALTIUM_TOOL\PCB_FOOTPRINTS\Altium_Footprint_Lib.PcbLib; PCB Footprint: RES0402_0-5
R500 R585 R589 = RESISTOR_Dup5: as R412 on sheet 37; PCB Footprint: RES0402_0-5; MECHANICAL 3D STEP FILE: RES0402_0-5; Voltage: NA; Wattage: 1/16W; Package: 0402; Distributor_name: DIGIKEY; Distributor_part_number: 541-0.0JCT-ND; Height: 0.40MM; Weight: 0.65mg; Temperature: -55癈+155癈; Datasheet: Y:\MIS_DATABASE\DATASHEETS\RESISTORS\CRCW0603.PDF; Crtd /date: MUDDU/190810; Chkd/date: VASANTHA/201216; Library Ref: RESISTOR; Footprint Ref: RES0402_0-5; Library Path: Y:\MIS_DATABASE\Library\ALTIUM_TOOL\SCHEMATICS_PARTS\MS_DISCRETE_Library.schlib; Footprint Path: Y:\MIS_DATABASE\Library\ALTIUM_TOOL\PCB_FOOTPRINTS\Altium_Footprint_Lib.PcbLib
R535 = RESISTOR_Dup6: RES 100K 1/16W 5% 0402; Mistral Part No: 110011060002-R; Mfr_name: VISHAY; Mfr_part_number: CRCW0402100KJNED; Part_type: RESISTORS\FIXED; Project: AM4515_EVM_LCD; Voltage: NA; Customs_HS_Code: 85332119; Custom_Duty: 15%; PCB Footprint: RES0402_0-5; Footprint Path: Y:\MIS_DATABASE\Library\ALTIUM_TOOL\PCB_FOOTPRINTS\Altium_Footprint_Lib.PcbLib; Library Path: Y:\MIS_DATABASE\Library\ALTIUM_TOOL\SCHEMATICS_PARTS\MS_DISCRETE_Library.schlib; Footprint Ref: RES0402_0-5; Library Ref: RESISTOR; Tolerance: 5%; Wattage: 1/16W; Package: 0402; Distributor_name: DIGIKEY; Distributor_part_number: 541-100KJCT-ND; Height: 0.40MM; Weight: 0.65mg; Temperature: -55癈+155癈; Datasheet: Y:\MIS_DATABASE\DATASHEETS\RESISTORS\CRCW0603.PDF; Crtd /date: BAVISH/010611; Chkd/date: VASANTHA/061216; MECHANICAL 3D STEP FILE: RES0402_0-5
R556 = RESISTOR_Dup6: RES 160E 1/10W 1% 0402; Mistral Part No: 110012050018-R; Mfr_name: PANASONIC-ECG; Mfr_part_number: ERJ-2RKF1600X; Part_type: RESISTORS\FIXED; Project: GEN_3-8; Voltage: NA; Customs_HS_Code: 85332119; Custom_Duty: 15%; Footprint Path: Y:\MIS_DATABASE\Library\ALTIUM_TOOL\PCB_FOOTPRINTS\Altium_Footprint_Lib.PcbLib; Library Path: Y:\MIS_DATABASE\Library\ALTIUM_TOOL\SCHEMATICS_PARTS\MS_DISCRETE_Library.schlib; Footprint Ref: RES0402_0-5; Tolerance: 1%; Wattage: 1/10W; Package: 0402; Distributor_name: DIGIKEY; Distributor_part_number: P160LCT-ND; Library Ref: RESISTOR; Height: 0.40MM; Weight: 0.8mg; Temperature: -55癈+155癈; Datasheet: Y:\MIS_DATABASE\DATASHEETS\RESISTORS\PAN-ERJSER_NOV17.PDF; Crtd /date: CHAITHANYA/220512; Chkd/date: VASANTHA/170217; MECHANICAL 3D STEP FILE: RES0402_0-5; PCB Footprint: RES0402_0-5
R586-R588 = RESISTOR_Dup5: as R577-R579 on sheet 37; PCB Footprint: RES0402_0-5; MECHANICAL 3D STEP FILE: RES0402_0-5; Chkd/date: VASANTHA/201216; Crtd /date: MUDDU/190810; Datasheet: Y:\MIS_DATABASE\DATASHEETS\RESISTORS\CRCW0603.PDF; Temperature: -55癈+155癈; Weight: 0.65mg; Height: 0.40MM; Distributor_part_number: 541-0.0JCT-ND; Distributor_name: DIGIKEY; Package: 0402; Wattage: 1/16W; Tolerance: NA; Library Ref: RESISTOR; Footprint Ref: RES0402_0-5; Library Path: Y:\MIS_DATABASE\Library\ALTIUM_TOOL\SCHEMATICS_PARTS\MS_DISCRETE_Library.schlib; Footprint Path: Y:\MIS_DATABASE\Library\ALTIUM_TOOL\PCB_FOOTPRINTS\Altium_Footprint_Lib.PcbLib
TP6 TP28 TP47 TP56 TP99 = TESTPOINT: as TP18 on sheet 37; Library Ref: TESTPOINT; Mfr_part_number: TP_40X65; Part_type: TESTPOINT; Package: THRU-HOLE; Distributor_name: NA; Distributor_part_number: NA; Height: NA; Datasheet: NA; Crtd /date: SHREESHAIL/041005; Chkd/date: MAZHAR/271211; PCB Footprint: TP_40X65
TP7 TP98 = TESTPOINT: as TP50 on sheet 38; Footprint Ref: TP20_SMD; Library Ref: TESTPOINT; Footprint Path: Y:\MIS_DATABASE\Library\ALTIUM_TOOL\PCB_FOOTPRINTS\Altium_Footprint_Lib.PcbLib; Library Path: Y:\MIS_DATABASE\Library\ALTIUM_TOOL\SCHEMATICS_PARTS\MS_DISCRETE_Library.schlib; Datasheet: NA; Temperature: NA; Weight: NA; Wattage: NA; Voltage: NA; Tolerance: NA; Chkd/date: SHREESHAIL/171006; Crtd /date: MAZHAR/171006; Height: NA; Distributor_part_number: NA; Distributor_name: NA; Package: SMD; Part_type: TESTPOINT; Mfr_part_number: TP20_SMD; Mistral Part No: NA; RoHS: NA; Customs_HS_Code: NA; Custom_Duty: NA; PCB Footprint: TP20_SMD
TP45 TP96 TP97 = TESTPOINT: TESTPOINT CIR 20 SMD; Mistral Part No: NA; Mfr_name: LOCAL; Project: BT MODULE_CSRBC04; PCB Footprint: TP20_SMD; Footprint Ref: TP20_SMD; Library Ref: TESTPOINT; Mfr_part_number: TP20_SMD; Part_type: TESTPOINT; Package: SMD; Distributor_name: NA; Distributor_part_number: NA; Height: NA; Crtd /date: MAZHAR/171006; Chkd/date: SHREESHAIL/171006; Tolerance: NA; Voltage: NA; Wattage: NA; Weight: NA; Temperature: NA; Datasheet: NA; MECHANICAL 3D STEP FILE: NA; Library Path: Y:\MIS_DATABASE\Library\ALTIUM_TOOL\SCHEMATICS_PARTS\MS_DISCRETE_Library.schlib; Footprint Path: Y:\MIS_DATABASE\Library\ALTIUM_TOOL\PCB_FOOTPRINTS\Altium_Footprint_Lib.PcbLib; RoHS: NA; Customs_HS_Code: NA; Custom_Duty: NA
TP48 = TESTPOINT: as TP12 on sheet 37; Library Ref: TESTPOINT; Chkd/date: MAZHAR/271211; Crtd /date: SHREESHAIL/041005; Datasheet: NA; Height: NA; Distributor_part_number: NA; Distributor_name: NA; Package: THRU-HOLE; Part_type: TESTPOINT; Mfr_part_number: TP_40X65; PCB Footprint: TP_40X65
U9 = TPS62097RWKT_VQFNHR11: as U5 on sheet 38; PCB Footprint: VQFNHR11_TPS62097_80X80_1; MECHANICAL 3D STEP FILE: VQFNHR11_TPS62097_80X80_1; Chkd/date: MANIRAJA/270917; Crtd /date: MANIRAJA/270917; Datasheet: Y:\MIS_DATABASE\DATASHEETS\ICS\POWER\TPS62097.PDF; Temperature: -40癈+125癈; Weight: NA; Height: 1.00MM; Distributor_part_number: 296-43330-1-ND; Distributor_name: DIGIKEY; Package: VQFN-HR11; Voltage: NA; Tolerance: NA; Mfr_part_number: TPS62097RWKT; Library Ref: TPS62097RWKT_VQFNHR11
U32 = TPS62097RWKT_VQFNHR11: IC 2A SYNCHRONOUS STEP DOWN CONVERTER WITH IDCS CONTROL VQFN-HR11; Mistral Part No: 142017090025-R; Mfr_name: TEXAS INSTRUMENTS; Part_type: ICS\POWER\CONVERTER; Project: TI_MAXIE_CPB; Tolerance: NA; Customs_HS_Code: 85423100; Custom_Duty: 15%; PCB Footprint: VQFNHR11_TPS62097_80X80_1; Library Ref: TPS62097RWKT_VQFNHR11; Mfr_part_number: TPS62097RWKT; Voltage: NA; Wattage: NA; Package: VQFN-HR11; Distributor_name: DIGIKEY; Distributor_part_number: 296-43330-1-ND; Height: 1.00MM; Weight: NA; Temperature: -40癈+125癈; Datasheet: Y:\MIS_DATABASE\DATASHEETS\ICS\POWER\TPS62097.PDF; Crtd /date: MANIRAJA/270917; Chkd/date: MANIRAJA/270917; MECHANICAL 3D STEP FILE: VQFNHR11_TPS62097_80X80_1
U62 = TPS73501DRVR_SON6: IC 500mA LOW DROPOUT HIGH PSRR LINEAR REGULATOR SON6; Part_type: ICS\POWER\VOLTAGE REGULATOR; Mfr_name: TEXAS INSTRUMENTS; Mistral Part No: 142017110007-R; Custom_Duty: 15%; Customs_HS_Code: 85423100; Wattage: NA; Project: TI_MAXIE_CPB; PCB Footprint: SON6_25-59_85X85_0-8; Library Ref: TPS73501DRVR_SON6; MECHANICAL 3D STEP FILE: SON6_25-59_85X85_0-8; Chkd/date: MANIRAJA/161117; Crtd /date: MANIRAJA/161117; Datasheet: Y:\MIS_DATABASE\DATASHEETS\ICS\POWER\TPS735.PDF; Temperature: -40癈+125癈; Weight: 9.7mg; Height: 0.80MM; Distributor_part_number: 296-27480-1-ND; Distributor_name: DIGIKEY; Package: SON6; Voltage: NA; Tolerance: NA; Mfr_part_number: TPS73525DRVR
U68 = TPS51206DSQR_WSON10: IC SINK/SOURCE DDR TERMINATION REGULATOR WSON10; Part_type: ICS\POWER\VOLTAGE REGULATOR; Mfr_name: TEXAS INSTRUMENTS; Mistral Part No: 142017090016-R; Custom_Duty: 15%; Customs_HS_Code: 85423100; Wattage: NA; Project: TI_MAXIE_CPB; Footprint Path: Y:\MIS_DATABASE\Library\ALTIUM_TOOL\PCB_FOOTPRINTS\Altium_Footprint_Lib.PcbLib; Library Path: Y:\MIS_DATABASE\Library\ALTIUM_TOOL\SCHEMATICS_PARTS\MS_MISCPOWER_Library.schlib; MECHANICAL 3D STEP FILE: EDFN10_15-74_80X80_0-8; Chkd/date: MANIRAJA/220917; Crtd /date: MANIRAJA/220917; Datasheet: Y:\MIS_DATABASE\DATASHEETS\ICS\POWER\TPS51206.PDF; Temperature: -40癈+85癈; Weight: NA; Height: 0.80MM; Distributor_part_number: 296-28767-1-ND; Distributor_name: DIGIKEY; Package: WSON10; Voltage: NA; Tolerance: NA; Mfr_part_number: TPS51206DSQR; Library Ref: TPS51206DSQR_WSON10; PCB Footprint: EDFN10_15-74_80X80_0-8
U77 = TLV71318PDQNR_X2SON4: IC 200mA LOW IQ LOW NOISE LDO REGULATOR FOR PORTABLE DEVICE X2SON-4; Mistral Part No: 142020050029-R; Mfr_name: TEXAS INSTRUMENTS; Part_type: ICS\POWER\VOLTAGE REGULATOR; Project: AM64x-GP_EVM BRD; Tolerance: NA; Customs_HS_Code: 85423100; Custom_Duty: 15%; PCB Footprint: X2SON4_TLV71318P_40X40_0-4; Footprint Ref: X2SON4_TLV71318P_40X40_0-4; Mfr_part_number: TLV70710DQNR; Voltage: NA; Wattage: NA; Package: X2SON-4; Distributor_name: DIGIKEY; Distributor_part_number: 296-40623-1-ND; Library Ref: TLV71318PDQNR_X2SON4; Height: 0.40MM; Weight: 4.1mg; Temperature: -40癈+125癈; Datasheet: Y:\MIS_DATABASE\DATASHEETS\ICS\POWER\TLV707X.PDF; Crtd /date: ALVY/250520; Chkd/date: MANIRAJA/270520; MECHANICAL 3D STEP FILE: X2SON4_TLV71318P_40X40_0-4; Library Path: Y:\MIS_DATABASE\Library\ALTIUM_TOOL\SCHEMATICS_PARTS\MS_MISCPOWER_Library.schlib; Footprint Path: Y:\MIS_DATABASE\Library\ALTIUM_TOOL\PCB_FOOTPRINTS\Altium_Footprint_Lib.PcbLib
U97 = TPS62177_WSON10: IC 3.3V 0.5A STEP DOWN CONVERTER WITH SLEEP MODE WSON10; Part_type: ICS\POWER\DC-DC CONVERTER; Mfr_name: TEXAS INSTRUMENTS; Mistral Part No: 142019070007-R; Custom_Duty: 15%; Customs_HS_Code: 85423100; Wattage: NA; Project: TI_MAXIE_CPB; PCB Footprint: WSON10_19-68_80X120_0-8; Footprint Path: Y:\MIS_DATABASE\Library\ALTIUM_TOOL\PCB_FOOTPRINTS\Altium_Footprint_Lib.PcbLib; Library Path: Y:\MIS_DATABASE\Library\ALTIUM_TOOL\SCHEMATICS_PARTS\MS_MISCPOWER_Library.schlib; MECHANICAL 3D STEP FILE: WSON10_19-68_80X120_0-8; Chkd/date: MANIRAJA/170719; Crtd /date: MANIRAJA/170719; Datasheet: Y:\MIS_DATABASE\DATASHEETS\ICS\POWER\TPS62177.PDF; Temperature: -40癈+85癈; Weight: 15mg; Height: 0.80MM; Footprint Ref: WSON10_19-68_80X120_0-8; Library Ref: TPS62177_WSON10; Distributor_part_number: 296-41856-1-ND; Distributor_name: DIGIKEY; Package: WSON10; Voltage: NA; Tolerance: NA; Mfr_part_number: TPS62177DQCR
U100 = TLV71318PDQNR_X2SON4: IC 200mA LOW IQ LOW NOISE LDO REGULATOR FOR PORTABLE DEVICE X2SON-4; Part_type: ICS\POWER\VOLTAGE REGULATOR; Mfr_name: TEXAS INSTRUMENTS; Mistral Part No: 142020040017-R; Custom_Duty: 15%; Customs_HS_Code: 85423100; Wattage: NA; Project: AM64x-GP_EVM BRD; PCB Footprint: X2SON4_TLV71318P_40X40_0-4; Footprint Path: Y:\MIS_DATABASE\Library\ALTIUM_TOOL\PCB_FOOTPRINTS\Altium_Footprint_Lib.PcbLib; Library Path: Y:\MIS_DATABASE\Library\ALTIUM_TOOL\SCHEMATICS_PARTS\MS_MISCPOWER_Library.schlib; MECHANICAL 3D STEP FILE: X2SON4_TLV71318P_40X40_0-4; Chkd/date: MANIRAJA/170420; Crtd /date: ALVY/160420; Datasheet: Y:\MIS_DATABASE\DATASHEETS\ICS\POWER\TLV707X.PDF; Temperature: -40癈+125癈; Weight: 1.5mg; Height: 0.40MM; Library Ref: TLV71318PDQNR_X2SON4; Distributor_part_number: 296-39289-1-ND; Distributor_name: DIGIKEY; Package: X2SON-4; Voltage: NA; Tolerance: NA; Mfr_part_number: TLV70728PDQNR; Footprint Ref: X2SON4_TLV71318P_40X40_0-4